# Altium project biv2-LRF_1a.PrjPcb
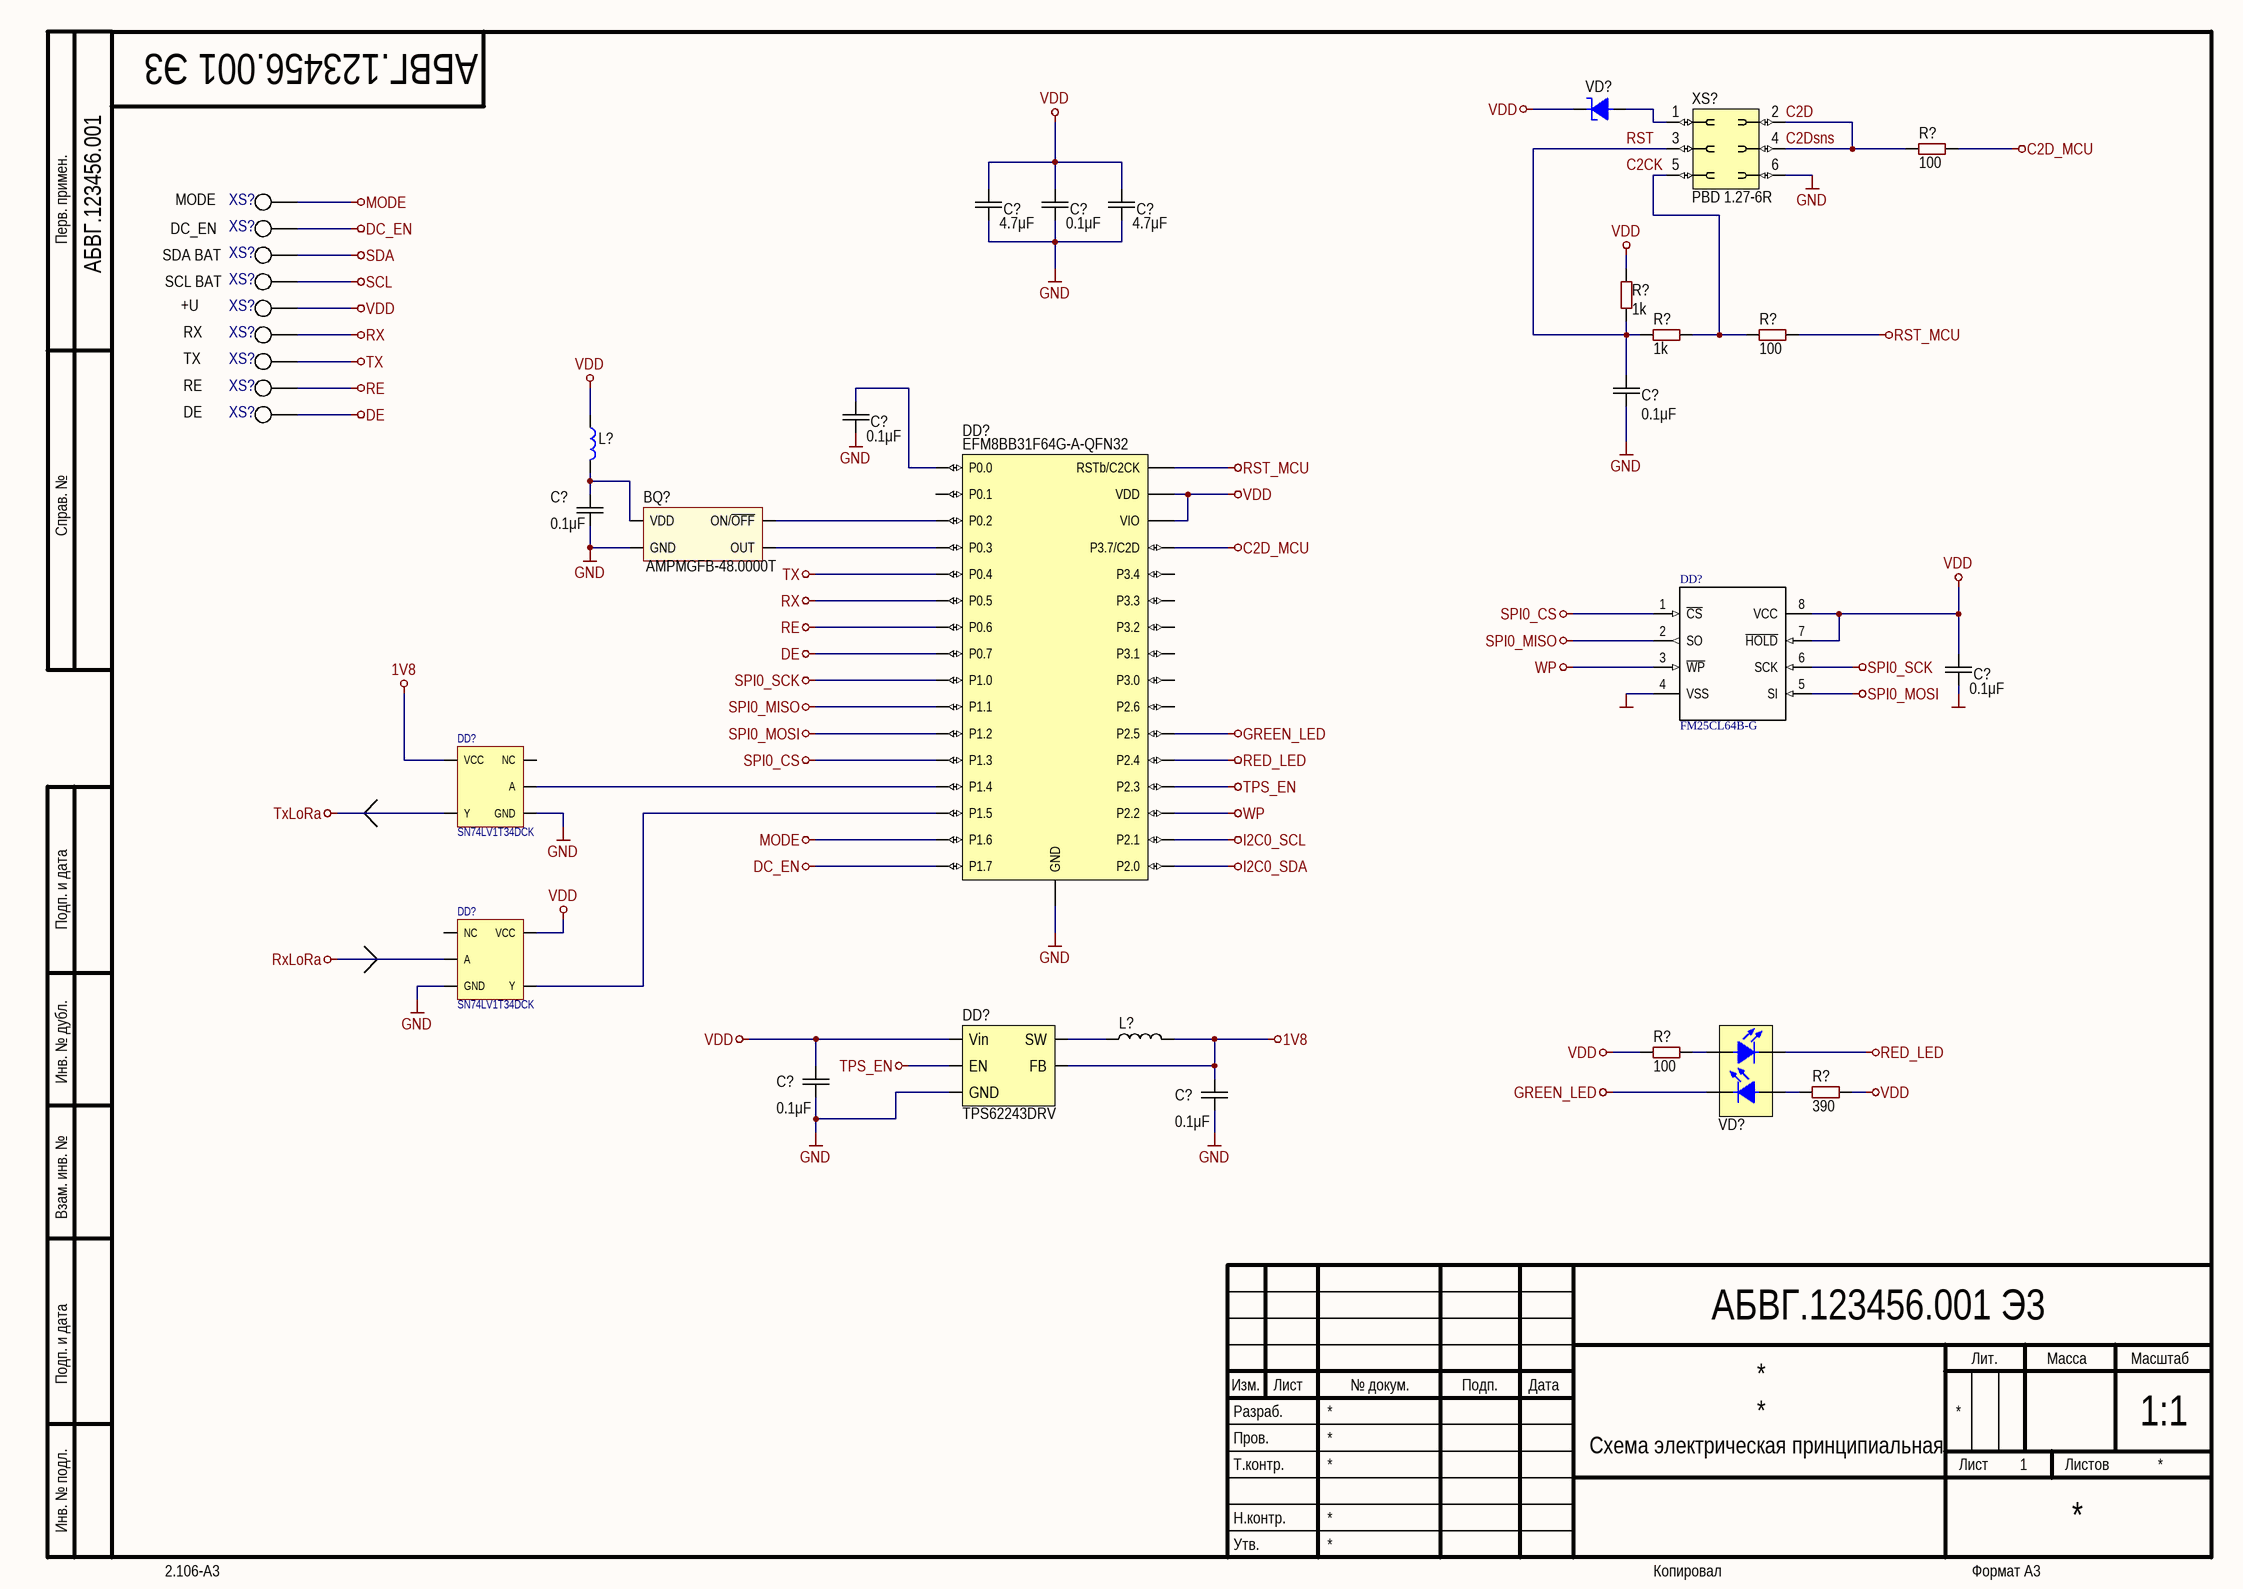
[diagram p0: MCUModule.SchDoc]
2 sheets, 78 parts. Net scope: global (net labels, ports and power ports of the same name join across sheets).
Sheets:
  MCUModule.SchDoc
  LoraModule.SchDoc

## Sheet MCUModule.SchDoc
size 420 x 297 mm; Address1: Address1; Address2: Address2; Address3: Address3; Address4: Address4; DocumentNumber: АБВГ.123456.001 Э3; SheetNumber: 1; Scale: 1:1; DocumentType: Схема электрическая принципиальная; FirstReferrence: АБВГ.123456.001

### Parts
(Parts that share a designator on the sheet are numbered #1, #2 ... from top to bottom, then left to right.)
BQ?  AMPMGFB-48.0000T  [AMPMGFB(1.6x1.2)]
C?#1  value 4.7μF  [CAP: 0603]
C?#2  value 0.1μF  [CAP: 0603]
C?#3  value 4.7μF  [CAP: 0603]
C?#4  value 0.1μF  [CAP: 0603]
C?#5  value 0.1μF  [CAP: 0603]
C?#6  value 0.1μF  [CAP: 0603]
C?#7  value 0.1μF  [CAP: 0603]
C?#8  value 0.1μF  [CAP: 0603]
C?#9  value 0.1μF  [CAP: 0603]
DD?#1  EFM8BB31F64G-A-QFN32  [32-QFN(4x4)]
DD?#2  FM25CL64B-G  [SO-8_N]
DD?#3  SN74LV1T34DCK  [SC70-5]
DD?#4  SN74LV1T34DCK  [SC70-5]
DD?#5  TPS62243DRV  [SOT23-5]
L?#1  BLM18AG102SN1D  [IND: 0603]  (value not drawn)
L?#2  VLF302515MT  [VLF302515MT]  (value not drawn)
R?#1  value 100  [RES: 0603]
R?#2  value 1k  [RES: 0603]
R?#3  value 1k  [RES: 0603]
R?#4  value 100  [RES: 0603]
R?#5  value 100  [RES: 0603]
R?#6  value 390  [RES: 0603]
VD?#1  (no value)  [DIODE: SOD523]
VD?#2  Dual LED  [KAA-3528]  (value not drawn)
XS?#1  PBD 1.27-6R  [CON: PBD1.27-6]
XS?#2  Testpoint_HS1mm  [TestPoint(1mm_HS)]  (value not drawn)
XS?#3  Testpoint_HS1mm  [TestPoint(1mm_HS)]  (value not drawn)
XS?#4  Testpoint_HS1mm  [TestPoint(1mm_HS)]  (value not drawn)
XS?#5  Testpoint_HS1mm  [TestPoint(1mm_HS)]  (value not drawn)
XS?#6  Testpoint_HS1mm  [TestPoint(1mm_HS)]  (value not drawn)
XS?#7  Testpoint_HS1mm  [TestPoint(1mm_HS)]  (value not drawn)
XS?#8  Testpoint_HS1mm  [TestPoint(1mm_HS)]  (value not drawn)
XS?#9  Testpoint_HS1mm  [TestPoint(1mm_HS)]  (value not drawn)
XS?#10  Testpoint_HS1mm  [TestPoint(1mm_HS)]  (value not drawn)

### Nets
1V8: C?#9.2 DD?#3.5(VCC) DD?#5.4(FB) L?#2.2
C2D_MCU: DD?#1.5(P3.7/C2D) R?#1.1
DC_EN: DD?#1.18(P1.7) XS?#3.1
DE: DD?#1.26(P0.7) XS?#10.1
GND: BQ?.2(GND) C?#1.1 C?#2.1 C?#3.1 C?#4.1 C?#5.1 C?#6.1 C?#7.1 C?#8.1 C?#9.1 DD?#1.0(GND) DD?#2.4(VSS) DD?#3.3(GND) DD?#4.3(GND) DD?#5.2(GND) XS?#1.6
GREEN_LED: DD?#1.12(P2.5) VD?#2.3(C)
I2C0_SCL: DD?#1.16(P2.1)
I2C0_SDA: DD?#1.17(P2.0)
MODE: DD?#1.19(P1.6) XS?#2.1
RE: DD?#1.27(P0.6) XS?#9.1
RED_LED: DD?#1.13(P2.4) VD?#2.1(C)
RST_MCU: DD?#1.4(RSTb/C2CK) R?#4.2
RX: DD?#1.28(P0.5) XS?#7.1
RxLoRa: DD?#4.2(A)
SCL: XS?#5.1
SDA: XS?#4.1
SPI0_CS: DD?#1.22(P1.3) DD?#2.1(~{CS})
SPI0_MISO: DD?#1.24(P1.1) DD?#2.2(SO)
SPI0_MOSI: DD?#1.23(P1.2) DD?#2.5(SI)
SPI0_SCK: DD?#1.25(P1.0) DD?#2.6(SCK)
TPS_EN: DD?#1.14(P2.3) DD?#5.3(EN)
TX: DD?#1.29(P0.4) XS?#8.1
TxLoRa: DD?#3.4(Y)
VDD: C?#1.2 C?#2.2 C?#3.2 C?#7.2 C?#8.2 DD?#1.2(VIO) DD?#1.3(VDD) DD?#2.7(~{HOLD}) DD?#2.8(VCC) DD?#4.5(VCC) DD?#5.1(Vin) L?#1.1 R?#2.1 R?#5.1 R?#6.2 VD?#1.2 XS?#6.1
WP: DD?#1.15(P2.2) DD?#2.3(~{WP})
C2D: R?#1.2 XS?#1.2 XS?#1.4  [also labelled C2Dsns]
RST: C?#4.2 R?#2.2 R?#3.1 XS?#1.3
NetBQ?_1: BQ?.1(ON/~{OFF}) DD?#1.31(P0.2)
NetBQ?_3: BQ?.3(OUT) DD?#1.30(P0.3)
NetBQ?_4: BQ?.4(VDD) C?#6.2 L?#1.2
NetC?#5_2: C?#5.2 DD?#1.1(P0.0)
NetDD?#1_20: DD?#1.20(P1.5) DD?#4.4(Y)
NetDD?#1_21: DD?#1.21(P1.4) DD?#3.2(A)
NetDD?#5_5: DD?#5.5(SW) L?#2.1
NetR?#3_2: R?#3.2 R?#4.1 XS?#1.5
NetR?#5_2: R?#5.2 VD?#2.2(A)
NetR?#6_1: R?#6.1 VD?#2.4(A)
NetVD?#1_1: VD?#1.1 XS?#1.1

Not connected (* = marked no-connect by the designer): DD?#1 6(P3.4) 7(P3.3) 8(P3.2) 9(P3.1) 10(P3.0) 11(P2.6) 32(P0.1); DD?#3 1(NC); DD?#4 1(NC)

### Notes on the sheet
- (near XS?#4) SDA BAT
- DC_EN
- MODE
- (near XS?#5) SCL BAT
- +U
- RX
- TX
- RE
- DE
- Labels drawn without touching a wire or pin: C2CK
- Перв. примен.
- Справ. №
- Подп. и дата
- Инв. № дубл.
- Взам. инв. №
- Разраб.
- Изм.
- Лист
- № докум.
- Подп.
- Дата
- Лит.
- Масса
- Масштаб
- Пров.
- Т.контр.
- Листов
- Инв. № подл.
- Утв.
- Н.контр.
- 2.106-A3
- Копировал
- Формат А3

### Library data of the parts
C?#1 C?#3 = Ceramic_0603: Manufacturer: Yageo; PartNumber: CC0603KRX7R7BB104; ValueManufacturerPartNumber: Ceramic capacitor, 4.7μF, X7R, ±10%, 16V, 0603, -55...+125°C; TypeCapacitor: Ceramic capacitor; Tolerance: ±10%; TypeDielectric: X7R; Voltage: 16V; Package: 0603; HelpURL: https://www.digikey.com/product-detail/en/yageo/CC0603KRX7R7BB104/311-1088-1-ND/302998; Temperature: -55...+125°C
C?#2 C?#4-C?#9 = Ceramic_0603: Manufacturer: Yageo; PartNumber: CC0603KRX7R7BB104; ValueManufacturerPartNumber: Ceramic capacitor, 0.1μF, X7R, ±10%, 16V, 0603, -55...+125°C; TypeCapacitor: Ceramic capacitor; Tolerance: ±10%; TypeDielectric: X7R; Voltage: 16V; Package: 0603; HelpURL: https://www.digikey.com/product-detail/en/yageo/CC0603KRX7R7BB104/311-1088-1-ND/302998; Temperature: -55...+125°C
DD?#1 = EFM8BB31F64G-A-QFN32: 8051 MCU Core
DD?#2 = FM25CL64B-G: Микросхема; ReplacementPart1Manufacturer: ISSI; ReplacementPart1PartNumber: IS25C08-2ZLI-TR; ComponentLink1Description: Manufacturer Link; ComponentLink1URL: http://www.microchip.com; ComponentLink2Description: Datasheet; ComponentLink3Description: Packaging Specification; PartNumber: FM25CL64B-G; Manufacturer: FM25CL64B-G
DD?#3 DD?#4 = SN74LV1T34DCK: Single Buffer; ComponentLink1Description: Datasheet; ComponentLink1URL: https://www.ti.com/lit/ds/symlink/sn74lv1t34.pdf?ts=1607003293244&ref_url=https%253A%252F%252Fwww.ti.com%252Fproduct%252FSN74LV1T34
DD?#5 = TPS62243DRV: Step-down converter 300mA
L?#1 = BLM18AG102SN1D: 100MHz 1K
R?#1 R?#4 R?#5 = Resistor_0603: Manufacturer: Yageo; PartNumber: RC0603JR-07100RL; ValueManufacturerPartNumber: Resistor film, 100, ±5%, 0603, 0.1W, -55...+125°C; TypeResistor: Resistor film; Power: 0.1W; Tolerance: ±5%; Package: 0603; HelpURL: https://www.digikey.com/product-detail/en/yageo/RC0603JR-07100RL/311-100GRCT-ND/729644; Temperature: -55...+125°C
R?#2 R?#3 = Resistor_0603: Manufacturer: Yageo; PartNumber: RC0603JR-07100RL; ValueManufacturerPartNumber: Resistor film, 1k, ±5%, 0603, 0.1W, -55...+125°C; TypeResistor: Resistor film; Power: 0.1W; Tolerance: ±5%; Package: 0603; HelpURL: https://www.digikey.com/product-detail/en/yageo/RC0603JR-07100RL/311-100GRCT-ND/729644; Temperature: -55...+125°C
R?#6 = Resistor_0603: Manufacturer: Yageo; PartNumber: RC0603JR-07100RL; ValueManufacturerPartNumber: Resistor film, 390, ±5%, 0603, 0.1W, -55...+125°C; TypeResistor: Resistor film; Power: 0.1W; Tolerance: ±5%; Package: 0603; HelpURL: https://www.digikey.com/product-detail/en/yageo/RC0603JR-07100RL/311-100GRCT-ND/729644; Temperature: -55...+125°C
VD?#1 = Schottky_single: Manufacturer: Diodes Incorporated; ValueManufacturerPartNumber: Schottky diode, 80V, 500mA, 1V, 15pF, SOD-123, -55...+150°C; PartNumber: BAT54XV2; TypeDiode: Schottky diode; Voltage: 80V; Current: 500mA; VoltageDrop: 1V; RecoveryTime: 15pF; Package: SOD-123; HelpURL: https://www.digikey.com/product-detail/en/diodes-incorporated/MBR0580S1-7/MBR0580S1-7DICT-ND/5080371; Temperature: -55...+150°C
VD?#2 = Dual LED: 2-1 RED, 4-3 GREEN; ComponentLink1Description: Datasheet; ComponentLink1URL: https://static.chipdip.ru/lib/935/DOC011935168.pdf

## Sheet LoraModule.SchDoc
size 420 x 297 mm; Address1: Address1; Address2: Address2; Address3: Address3; Address4: Address4; DocumentNumber: АБВГ.123456.001 Э3; SheetNumber: 1; Scale: 1:1; DocumentType: Схема электрическая принципиальная; FirstReferrence: АБВГ.123456.001
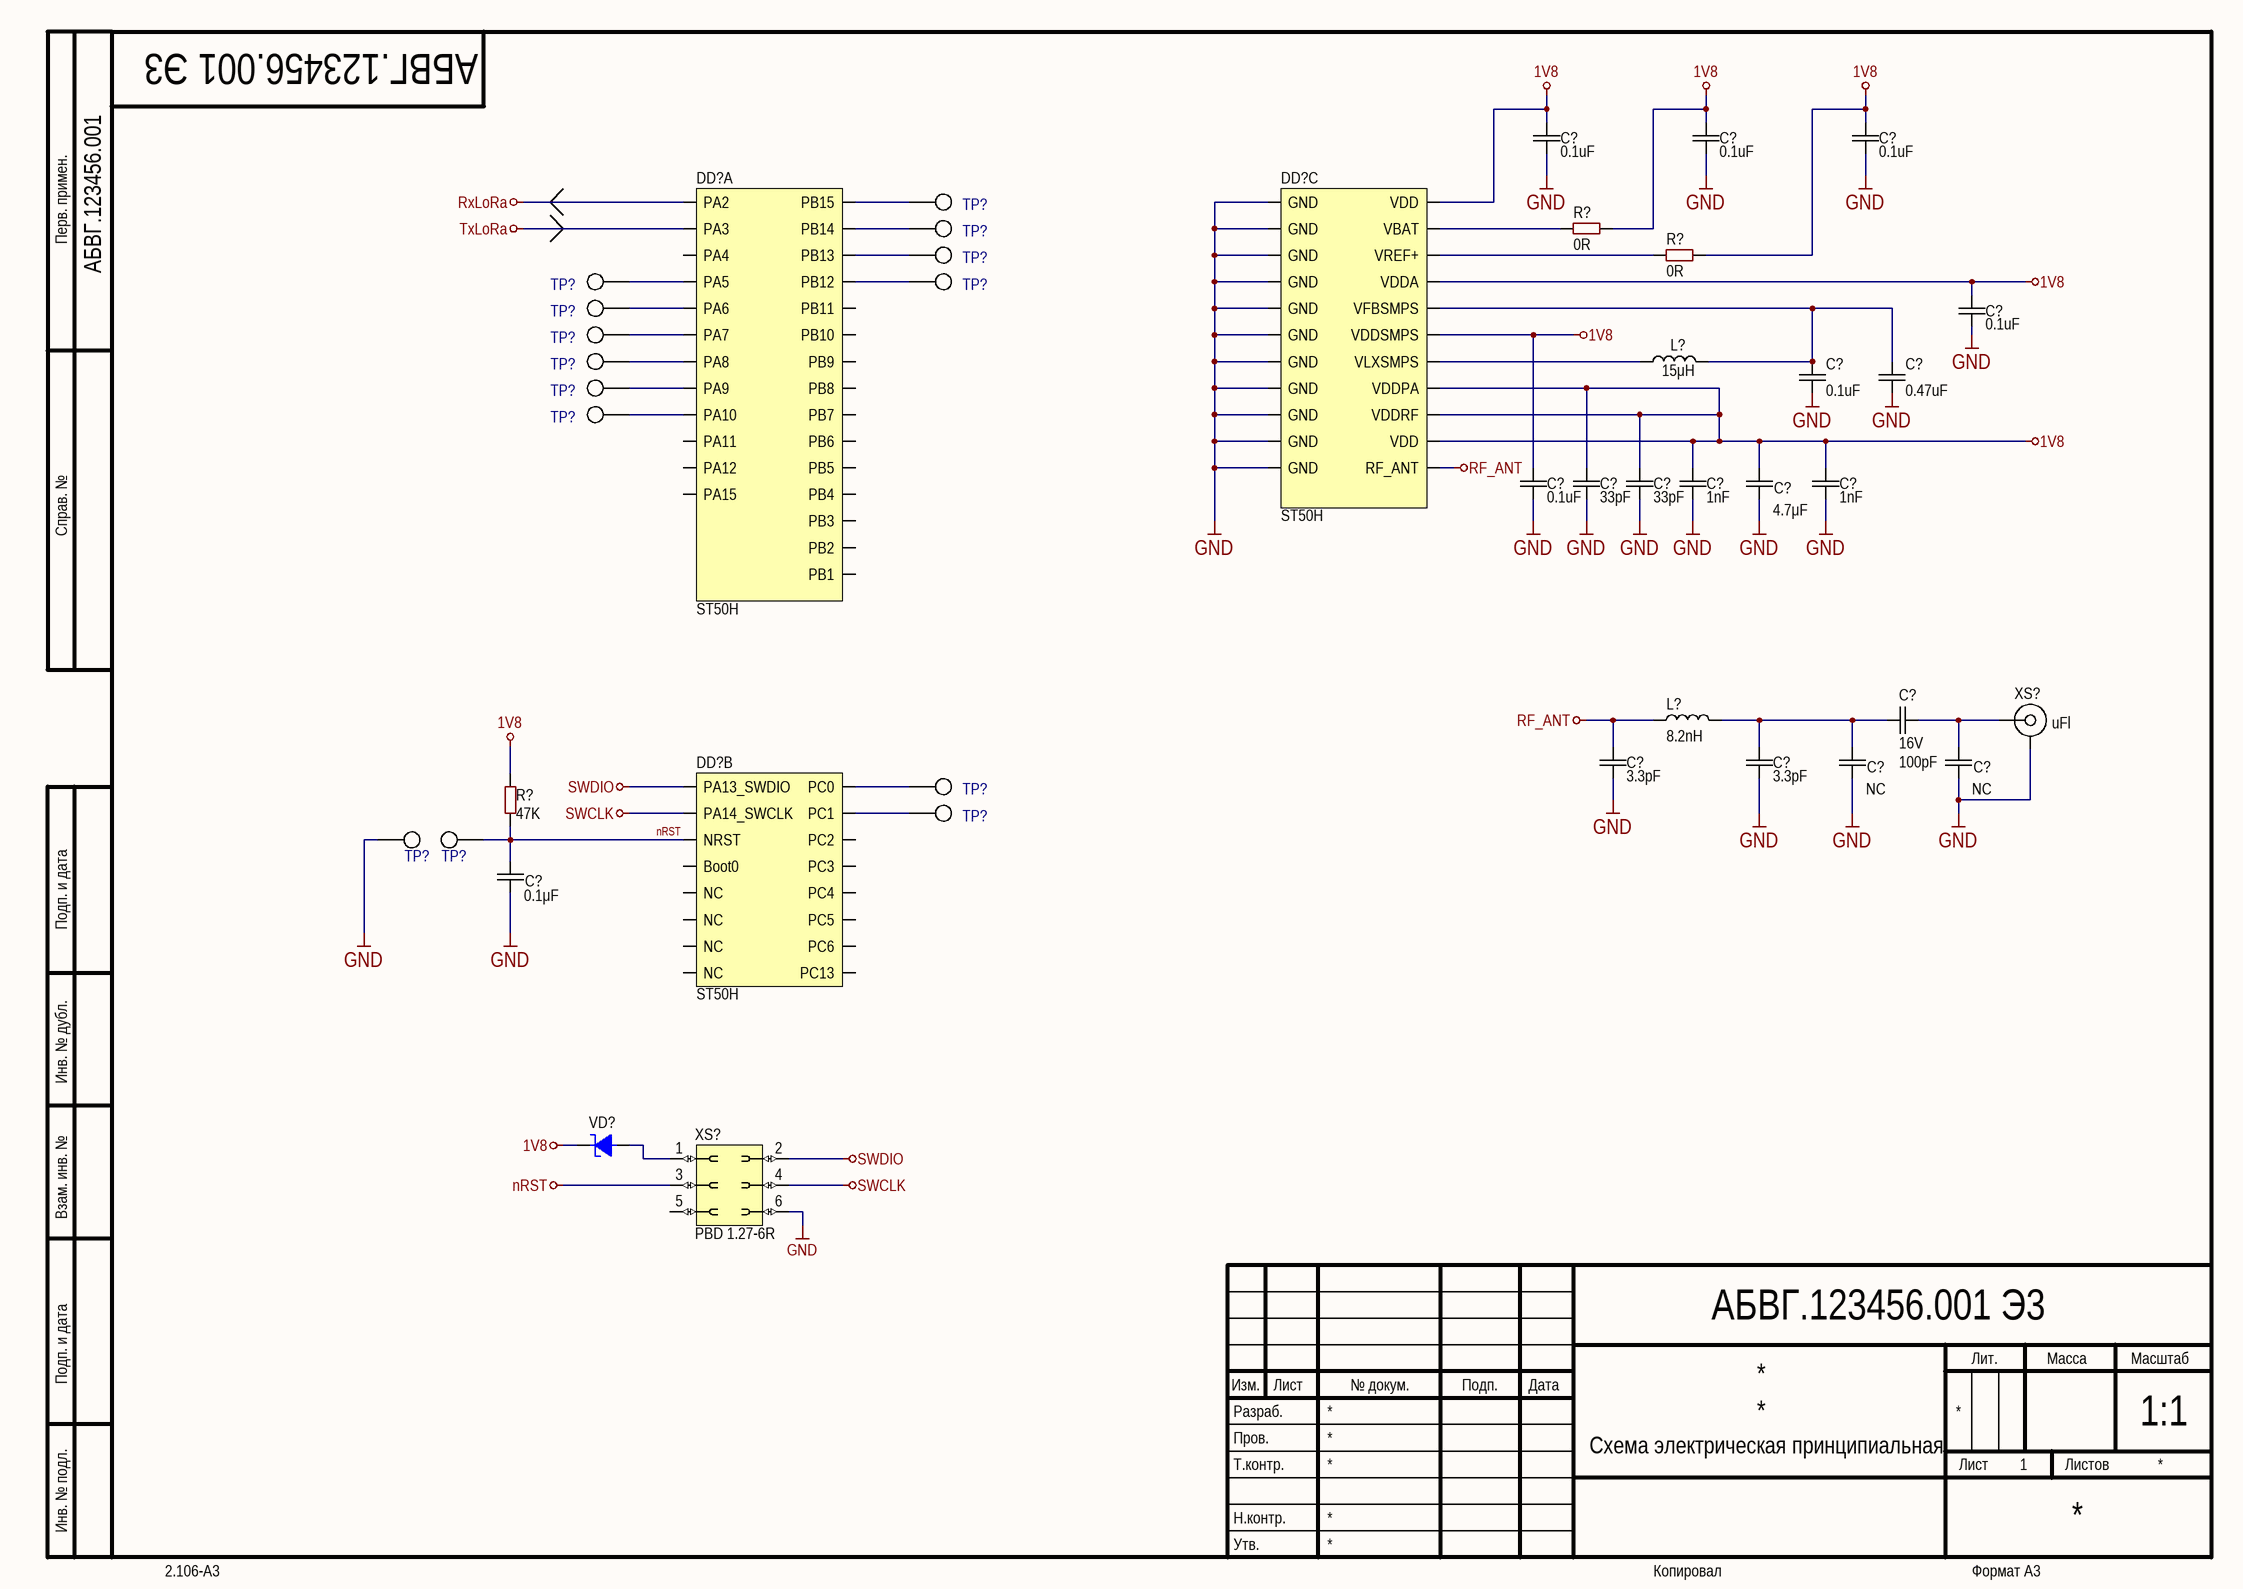
[diagram p1: LoraModule.SchDoc]

### Parts
(Parts that share a designator on the sheet are numbered #1, #2 ... from top to bottom, then left to right.)
C?#10  value 0.1uF  [CAP: 0402]
C?#11  value 0.1uF  [CAP: 0402]
C?#12  value 0.1uF  [CAP: 0402]
C?#13  value 0.1uF  [CAP: 0402]
C?#14  value 0.1uF  [CAP: 0402]
C?#15  value 0.47uF  [CAP: 0402]
C?#16  value 0.1uF  [CAP: 0402]
C?#17  value 33pF  [CAP: 0402]
C?#18  value 33pF  [CAP: 0402]
C?#19  value 1nF  [CAP: 0402]
C?#20  value 4.7μF  [CAP: 0603]
C?#21  value 1nF  [CAP: 0402]
C?#22  value 100pF  Voltage: 16V  [CAP: 0603]
C?#23  value 3.3pF  [CAP: 0402]
C?#24  value 3.3pF  [CAP: 0402]
C?#25  value NC  [CAP: 0603]
C?#26  value NC  [CAP: 0603]
C?#27  value 0.1μF  [CAP: 0402]
DD?#6  ST50H  [ST50H]  (part A of 3)
DD?#7  ST50H  [ST50H]  (part C of 3)
DD?#8  ST50H  [ST50H]  (part B of 3)
L?#3  value 15μH  [IND: 0805]
L?#4  value 8.2nH  [IND: 0402]
R?#7  value 0R  [RES: 0402]
R?#8  value 0R  [RES: 0402]
R?#9  value 47K  [RES: 0402]
TP?#1  Testpoint_HS1mm  [TestPoint(1mm_HS)]  (value not drawn)
TP?#2  Testpoint_HS1mm  [TestPoint(1mm_HS)]  (value not drawn)
TP?#3  Testpoint_HS1mm  [TestPoint(1mm_HS)]  (value not drawn)
TP?#4  Testpoint_HS1mm  [TestPoint(1mm_HS)]  (value not drawn)
TP?#5  Testpoint_HS1mm  [TestPoint(1mm_HS)]  (value not drawn)
TP?#6  Testpoint_HS1mm  [TestPoint(1mm_HS)]  (value not drawn)
TP?#7  Testpoint_HS1mm  [TestPoint(1mm_HS)]  (value not drawn)
TP?#8  Testpoint_HS1mm  [TestPoint(1mm_HS)]  (value not drawn)
TP?#9  Testpoint_HS1mm  [TestPoint(1mm_HS)]  (value not drawn)
TP?#10  Testpoint_HS1mm  [TestPoint(1mm_HS)]  (value not drawn)
TP?#11  Testpoint_HS1mm  [TestPoint(1mm_HS)]  (value not drawn)
TP?#12  Testpoint_HS1mm  [TestPoint(1mm_HS)]  (value not drawn)
TP?#13  Testpoint_HS1mm  [TestPoint(1mm_HS)]  (value not drawn)
TP?#14  Testpoint_HS1mm  [TestPoint(1mm_HS)]  (value not drawn)
VD?#3  (no value)  [DIODE: SOD523]
XS?#11  CommentText: uFl  [CON: u.Fl]
XS?#12  PBD 1.27-6R  [CON: PBD1.27-6]

### Nets
1V8: C?#10.2 C?#11.2 C?#12.2 C?#13.2 C?#16.2 C?#17.2 C?#18.2 C?#19.2 C?#20.2 C?#21.2 DD?#7.3(VDD) DD?#7.7(VDDA) DD?#7.11(VDDSMPS) DD?#7.53(VDDPA) DD?#7.54(VDDRF) DD?#7.55(VDD) R?#7.2 R?#8.2 R?#9.1 VD?#3.2
GND: C?#10.1 C?#11.1 C?#12.1 C?#13.1 C?#14.1 C?#15.2 C?#16.1 C?#17.1 C?#18.1 C?#19.1 C?#20.1 C?#21.1 C?#23.1 C?#24.1 C?#25.1 C?#26.1 C?#27.1 DD?#7.12(GND) DD?#7.28(GND) DD?#7.35(GND) DD?#7.36(GND) DD?#7.38(GND) DD?#7.39(GND) DD?#7.46(GND) DD?#7.47(GND) DD?#7.52(GND) DD?#7.56(GND) DD?#7.65(GND) TP?#13.1 XS?#11.2 XS?#12.6
nRST: C?#27.2 DD?#8.44(NRST) R?#9.2 TP?#14.1 XS?#12.3
RF_ANT: C?#23.2 DD?#7.37(RF_ANT) L?#4.1
RxLoRa: DD?#6.29(PA2)
SWCLK: DD?#8.2(PA14_SWCLK) XS?#12.4
SWDIO: DD?#8.1(PA13_SWDIO) XS?#12.2
TxLoRa: DD?#6.30(PA3)
NetC?#14_2: C?#14.2 C?#15.1 DD?#7.10(VFBSMPS) L?#3.2
NetC?#22_1: C?#22.1 C?#26.2 XS?#11.1
NetC?#22_2: C?#22.2 C?#24.2 C?#25.2 L?#4.2
NetDD?#6_9: DD?#6.9(PB15) TP?#1.1
NetDD?#6_32: DD?#6.32(PA5) TP?#4.1
NetDD?#6_33: DD?#6.33(PA6) TP?#6.1
NetDD?#6_34: DD?#6.34(PA7) TP?#7.1
NetDD?#6_50: DD?#6.50(PA9) TP?#9.1
NetDD?#6_51: DD?#6.51(PA8) TP?#8.1
NetDD?#6_59: DD?#6.59(PB12) TP?#5.1
NetDD?#6_60: DD?#6.60(PB13) TP?#3.1
NetDD?#6_61: DD?#6.61(PB14) TP?#2.1
NetDD?#6_62: DD?#6.62(PA10) TP?#10.1
NetDD?#7_4: DD?#7.4(VBAT) R?#7.1
NetDD?#7_6: DD?#7.6(VREF+) R?#8.1
NetDD?#7_13: DD?#7.13(VLXSMPS) L?#3.1
NetDD?#8_21: DD?#8.21(PC0) TP?#11.1
NetDD?#8_22: DD?#8.22(PC1) TP?#12.1
NetVD?#3_1: VD?#3.1 XS?#12.1

Not connected (* = marked no-connect by the designer): DD?#6 8(PA15) 14(PB3) 15(PB4) 16(PB5) 17(PB6) 18(PB7) 19(PB8) 20(PB9) 31(PA4) 48(PB11) 49(PB10) 57(PB1) 58(PB2) 63(PA11) 64(PA12); DD?#8 5(PC13) 23(PC2) 24(PC3) 25(PC4) 26(PC5) 27(PC6) 40(NC) 41(NC) 42(NC) 43(Boot0) 45(NC); XS?#12 5

### Notes on the sheet
- Перв. примен.
- Справ. №
- Подп. и дата
- Инв. № дубл.
- Взам. инв. №
- Разраб.
- Изм.
- Лист
- № докум.
- Подп.
- Дата
- Лит.
- Масса
- Масштаб
- Пров.
- Т.контр.
- Листов
- Инв. № подл.
- Утв.
- Н.контр.
- 2.106-A3
- Копировал
- Формат А3

### Library data of the parts
C?#10-C?#14 C?#16 = Ceramic_0402: Manufacturer: Yageo; PartNumber: CC0402KRX7R7BB104; ValueManufacturerPartNumber: Ceramic capacitor, 0.1uF, X7R, ±10%, 16V, 0402, -55...+125°C; TypeCapacitor: Ceramic capacitor; Tolerance: ±10%; TypeDielectric: X7R; Voltage: 16V; Package: 0402; HelpURL: https://www.digikey.com/product-detail/en/yageo/CC0402KRX7R7BB104/311-1338-1-ND/2103122; Temperature: -55...+125°C
C?#15 = Ceramic_0402: Manufacturer: Yageo; PartNumber: CC0402KRX7R7BB104; ValueManufacturerPartNumber: Ceramic capacitor, 0.47uF, X7R, ±10%, 16V, 0402, -55...+125°C; TypeCapacitor: Ceramic capacitor; Tolerance: ±10%; TypeDielectric: X7R; Voltage: 16V; Package: 0402; HelpURL: https://www.digikey.com/product-detail/en/yageo/CC0402KRX7R7BB104/311-1338-1-ND/2103122; Temperature: -55...+125°C
C?#17 C?#18 = Ceramic_0402: Manufacturer: Yageo; PartNumber: CC0402KRX7R7BB104; ValueManufacturerPartNumber: Ceramic capacitor, 33pF, X7R, ±10%, 16V, 0402, -55...+125°C; TypeCapacitor: Ceramic capacitor; Tolerance: ±10%; TypeDielectric: X7R; Voltage: 16V; Package: 0402; HelpURL: https://www.digikey.com/product-detail/en/yageo/CC0402KRX7R7BB104/311-1338-1-ND/2103122; Temperature: -55...+125°C
C?#19 C?#21 = Ceramic_0402: Manufacturer: Yageo; PartNumber: CC0402KRX7R7BB104; ValueManufacturerPartNumber: Ceramic capacitor, 1nF, X7R, ±10%, 16V, 0402, -55...+125°C; TypeCapacitor: Ceramic capacitor; Tolerance: ±10%; TypeDielectric: X7R; Voltage: 16V; Package: 0402; HelpURL: https://www.digikey.com/product-detail/en/yageo/CC0402KRX7R7BB104/311-1338-1-ND/2103122; Temperature: -55...+125°C
C?#20 = Ceramic_0603: as C?#1 on sheet MCUModule; Package: 0603; HelpURL: https://www.digikey.com/product-detail/en/yageo/CC0603KRX7R7BB104/311-1088-1-ND/302998; Temperature: -55...+125°C
C?#22 = Ceramic_0603: Manufacturer: Yageo; PartNumber: CC0603KRX7R7BB104; ValueManufacturerPartNumber: Ceramic capacitor, 100pF, X7R, ±10%, 16V, 0603, -55...+125°C; TypeCapacitor: Ceramic capacitor; Tolerance: ±10%; TypeDielectric: X7R; Package: 0603; HelpURL: https://www.digikey.com/product-detail/en/yageo/CC0603KRX7R7BB104/311-1088-1-ND/302998; Temperature: -55...+125°C
C?#23 C?#24 = Ceramic_0402: Manufacturer: Yageo; PartNumber: CC0402KRX7R7BB104; ValueManufacturerPartNumber: Ceramic capacitor, 3.3pF, X7R, ±10%, 16V, 0402, -55...+125°C; TypeCapacitor: Ceramic capacitor; Tolerance: ±10%; TypeDielectric: X7R; Voltage: 16V; Package: 0402; HelpURL: https://www.digikey.com/product-detail/en/yageo/CC0402KRX7R7BB104/311-1338-1-ND/2103122; Temperature: -55...+125°C
C?#25 C?#26 = Ceramic_0603: Manufacturer: Yageo; PartNumber: CC0603KRX7R7BB104; ValueManufacturerPartNumber: Ceramic capacitor, NC, X7R, ±10%, 16V, 0603, -55...+125°C; TypeCapacitor: Ceramic capacitor; Tolerance: ±10%; TypeDielectric: X7R; Voltage: 16V; Package: 0603; HelpURL: https://www.digikey.com/product-detail/en/yageo/CC0603KRX7R7BB104/311-1088-1-ND/302998; Temperature: -55...+125°C
C?#27 = Ceramic_0402: Manufacturer: Yageo; PartNumber: CC0402KRX7R7BB104; ValueManufacturerPartNumber: Ceramic capacitor, 0.1μF, X7R, ±10%, 16V, 0402, -55...+125°C; TypeCapacitor: Ceramic capacitor; Tolerance: ±10%; TypeDielectric: X7R; Voltage: 16V; Package: 0402; HelpURL: https://www.digikey.com/product-detail/en/yageo/CC0402KRX7R7BB104/311-1338-1-ND/2103122; Temperature: -55...+125°C
DD?#6-DD?#8 = ST50H: LoRa module
L?#3 = Inductor_0805: Manufacturer: Murata Electronics; PartNumber: LQM21FN100M70L; ValueManufacturerPartNumber: Fixed inductor, 15μH, ±20%, 0805, 100mA, -55...+125°C; TypeInductor: Fixed inductor; MaxCurrent: 100mA; Tolerance: ±20%; Package: 0805; HelpURL: https://www.digikey.com/product-detail/en/murata-electronics-north-america/LQM21FN100M70L/490-4029-1-ND/1016289; Temperature: -55...+125°C
L?#4 = Inductor_0402: Manufacturer: Murata Electronics; PartNumber: LQG15HSR10J02D; ValueManufacturerPartNumber: Fixed inductor, 8.2nH, ±5%, 0402, 200mA, -55...+125°C; TypeInductor: Fixed inductor; MaxCurrent: 200mA; Tolerance: ±5%; Package: 0402; HelpURL: https://www.digikey.com/product-detail/en/murata-electronics-north-america/LQG15HSR10J02D/490-2635-1-ND/662915; Temperature: -55...+125°C
R?#7 R?#8 = Resistor_0402: Manufacturer: Yageo; PartNumber: RC0402JR-07100RL; ValueManufacturerPartNumber: Resistor film, 0R, ±5%, 0402, 0.063W, -55...+125°C; TypeResistor: Resistor film; Power: 0.063W; Tolerance: ±5%; Package: 0402; HelpURL: https://www.digikey.com/product-detail/en/yageo/RC0402JR-07100RL/311-100JRCT-ND/729362; Temperature: -55...+125°C
R?#9 = Resistor_0402: Manufacturer: Yageo; PartNumber: RC0402JR-07100RL; ValueManufacturerPartNumber: Resistor film, 47K, ±5%, 0402, 0.063W, -55...+125°C; TypeResistor: Resistor film; Power: 0.063W; Tolerance: ±5%; Package: 0402; HelpURL: https://www.digikey.com/product-detail/en/yageo/RC0402JR-07100RL/311-100JRCT-ND/729362; Temperature: -55...+125°C
VD?#3 = Schottky_single: as VD?#1 on sheet MCUModule; Package: SOD-123; HelpURL: https://www.digikey.com/product-detail/en/diodes-incorporated/MBR0580S1-7/MBR0580S1-7DICT-ND/5080371; Temperature: -55...+150°C
XS?#11 = Connector_uFL: Manufacturer: Hirose Electric; ValueManufacturerPartNumber: Connector u.FL, 50 Ohm, 6GHz; PartNumber: U.FL-R-SMT(01); TypeConnector: Connector u.FL; Frequency: 6GHz; Impedance: 50 Ohm; HelpURL: https://www.digikey.com/product-detail/en/hirose-electric-co-ltd/U.FL-R-SMT-01/H9161-ND/513010

## Nets that join several sheets
1V8: MCUModule (C?#9.2 DD?#3.5 DD?#5.4 L?#2.2), LoraModule (20 pins)
GND: MCUModule (16 pins), LoraModule (31 pins)
RxLoRa: MCUModule (DD?#4.2), LoraModule (DD?#6.29)
TxLoRa: MCUModule (DD?#3.4), LoraModule (DD?#6.30)